# Altium project Fastino.PrjPCB (part 1 of 6)
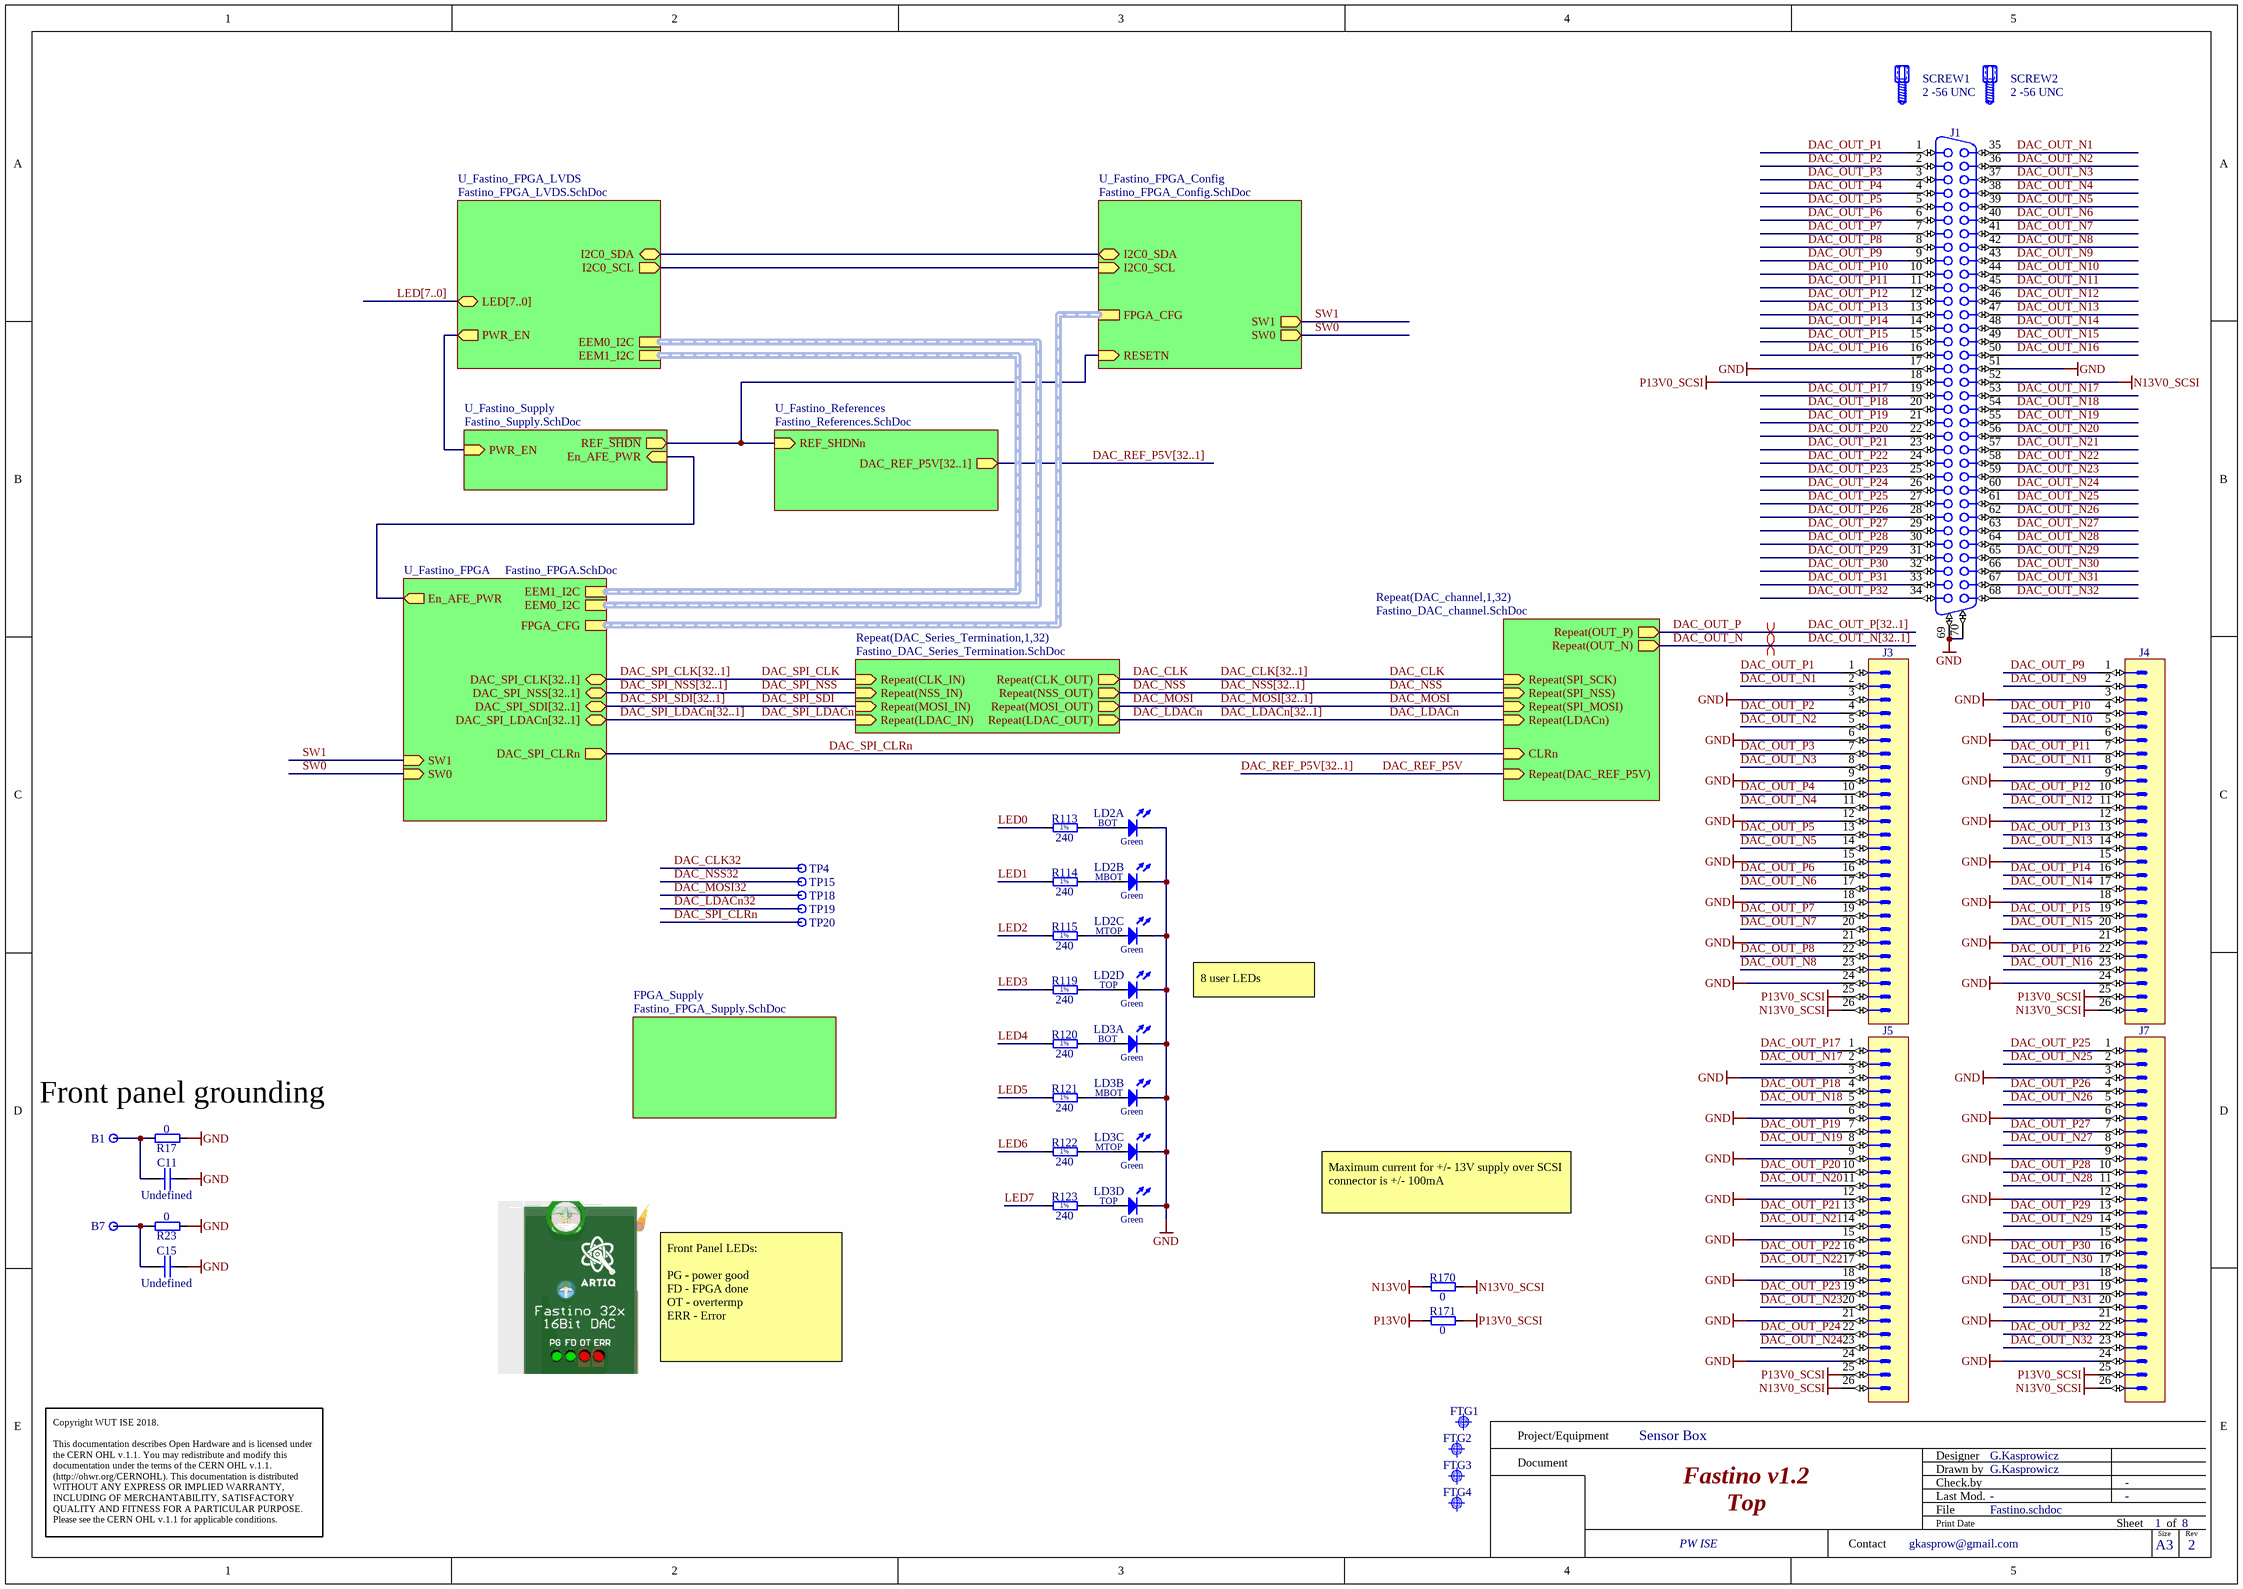
[diagram p0: Fastino.schdoc]
9 sheets, 1598 parts. Net scope: hierarchical (ports join the sheet entries above them; power ports are global).
Board files: Fastino.PCBDOC, Panel_Fastino.PcbDoc
Sheets:
  Fastino.schdoc
    DAC_channel1 = Fastino_DAC_channel.SchDoc
    DAC_channel2 = Fastino_DAC_channel.SchDoc
    DAC_channel3 = Fastino_DAC_channel.SchDoc
    DAC_channel4 = Fastino_DAC_channel.SchDoc
    DAC_channel5 = Fastino_DAC_channel.SchDoc
    DAC_channel6 = Fastino_DAC_channel.SchDoc
    DAC_channel7 = Fastino_DAC_channel.SchDoc
    DAC_channel8 = Fastino_DAC_channel.SchDoc
    DAC_channel9 = Fastino_DAC_channel.SchDoc
    DAC_channel10 = Fastino_DAC_channel.SchDoc
    DAC_channel11 = Fastino_DAC_channel.SchDoc
    DAC_channel12 = Fastino_DAC_channel.SchDoc
    DAC_channel13 = Fastino_DAC_channel.SchDoc
    DAC_channel14 = Fastino_DAC_channel.SchDoc
    DAC_channel15 = Fastino_DAC_channel.SchDoc
    DAC_channel16 = Fastino_DAC_channel.SchDoc
    DAC_channel17 = Fastino_DAC_channel.SchDoc
    DAC_channel18 = Fastino_DAC_channel.SchDoc
    DAC_channel19 = Fastino_DAC_channel.SchDoc
    DAC_channel20 = Fastino_DAC_channel.SchDoc
    DAC_channel21 = Fastino_DAC_channel.SchDoc
    DAC_channel22 = Fastino_DAC_channel.SchDoc
    DAC_channel23 = Fastino_DAC_channel.SchDoc
    DAC_channel24 = Fastino_DAC_channel.SchDoc
    DAC_channel25 = Fastino_DAC_channel.SchDoc
    DAC_channel26 = Fastino_DAC_channel.SchDoc
    DAC_channel27 = Fastino_DAC_channel.SchDoc
    DAC_channel28 = Fastino_DAC_channel.SchDoc
    DAC_channel29 = Fastino_DAC_channel.SchDoc
    DAC_channel30 = Fastino_DAC_channel.SchDoc
    DAC_channel31 = Fastino_DAC_channel.SchDoc
    DAC_channel32 = Fastino_DAC_channel.SchDoc
    U_Fastino_FPGA = Fastino_FPGA.SchDoc
    U_Fastino_FPGA_Config = Fastino_FPGA_Config.SchDoc
    U_Fastino_FPGA_LVDS = Fastino_FPGA_LVDS.SchDoc
    FPGA_Supply = Fastino_FPGA_Supply.SchDoc
    U_Fastino_References = Fastino_References.SchDoc
    U_Fastino_Supply = Fastino_Supply.SchDoc
    DAC_Series_Termination1 = Fastino_DAC_Series_Termination.SchDoc
    DAC_Series_Termination2 = Fastino_DAC_Series_Termination.SchDoc
    DAC_Series_Termination3 = Fastino_DAC_Series_Termination.SchDoc
    DAC_Series_Termination4 = Fastino_DAC_Series_Termination.SchDoc
    DAC_Series_Termination5 = Fastino_DAC_Series_Termination.SchDoc
    DAC_Series_Termination6 = Fastino_DAC_Series_Termination.SchDoc
    DAC_Series_Termination7 = Fastino_DAC_Series_Termination.SchDoc
    DAC_Series_Termination8 = Fastino_DAC_Series_Termination.SchDoc
    DAC_Series_Termination9 = Fastino_DAC_Series_Termination.SchDoc
    DAC_Series_Termination10 = Fastino_DAC_Series_Termination.SchDoc
    DAC_Series_Termination11 = Fastino_DAC_Series_Termination.SchDoc
    DAC_Series_Termination12 = Fastino_DAC_Series_Termination.SchDoc
    DAC_Series_Termination13 = Fastino_DAC_Series_Termination.SchDoc
    DAC_Series_Termination14 = Fastino_DAC_Series_Termination.SchDoc
    DAC_Series_Termination15 = Fastino_DAC_Series_Termination.SchDoc
    DAC_Series_Termination16 = Fastino_DAC_Series_Termination.SchDoc
    DAC_Series_Termination17 = Fastino_DAC_Series_Termination.SchDoc
    DAC_Series_Termination18 = Fastino_DAC_Series_Termination.SchDoc
    DAC_Series_Termination19 = Fastino_DAC_Series_Termination.SchDoc
    DAC_Series_Termination20 = Fastino_DAC_Series_Termination.SchDoc
    DAC_Series_Termination21 = Fastino_DAC_Series_Termination.SchDoc
    DAC_Series_Termination22 = Fastino_DAC_Series_Termination.SchDoc
    DAC_Series_Termination23 = Fastino_DAC_Series_Termination.SchDoc
    DAC_Series_Termination24 = Fastino_DAC_Series_Termination.SchDoc
    DAC_Series_Termination25 = Fastino_DAC_Series_Termination.SchDoc
    DAC_Series_Termination26 = Fastino_DAC_Series_Termination.SchDoc
    DAC_Series_Termination27 = Fastino_DAC_Series_Termination.SchDoc
    DAC_Series_Termination28 = Fastino_DAC_Series_Termination.SchDoc
    DAC_Series_Termination29 = Fastino_DAC_Series_Termination.SchDoc
    DAC_Series_Termination30 = Fastino_DAC_Series_Termination.SchDoc
    DAC_Series_Termination31 = Fastino_DAC_Series_Termination.SchDoc
    DAC_Series_Termination32 = Fastino_DAC_Series_Termination.SchDoc

## Sheet Fastino.schdoc: Fastino v1.2
size 420 x 297 mm; EDA_Number: ARTIQ; Projet: Fastino; Author: G.Kasprowicz; CompanyName: WUT ISE; DrawnBy: G.Kasprowicz; Organization: WUT ISE; Address1: PW ISE; Address2: Nowowiejska 15/19 00-665 Warsaw; Address3: gkasprow@gmail.com; DocumentNumber: 1; Revision: 2; SheetNumber: 1; SheetTotal: 8; ModifiedBy: -; CheckedDate: -; Title2: Top; DivGrp: WUT ISE; Designer: G.Kasprowicz; ModifiedDate: -; ProjectName: Sensor Box

### Parts
(Parts that share a designator on the sheet are numbered #1, #2 ... from top to bottom, then left to right.)
B1  Plated Hole  [MTG270_500]  (value not drawn)
B7  Plated Hole  [MTG270_500]  (value not drawn)
C11  Undefined  [CAPC2012X135N]
C15  Undefined  [CAPC2012X135N]
FTG1  Use only in PCB  [FIDUCIAL_TOP_C100-200]  (value not drawn)
FTG2  Use only in PCB  [FIDUCIAL_TOP_S100-200]  (value not drawn)
FTG3  Use only in PCB  [FIDUCIAL_TOP_S100-200]  (value not drawn)
FTG4  Use only in PCB  [FIDUCIAL_TOP_S100-200]  (value not drawn)
J1  D-SUB  [TYCO_5787082-7]  (value not drawn)
J3  Header 26  [3M_N2526-6002RB]  (value not drawn)
J4  Header 26  [3M_N2526-6002RB]  (value not drawn)
J5  Header 26  [3M_N2526-6002RB]  (value not drawn)
J7  Header 26  [3M_N2526-6002RB]  (value not drawn)
LD2  Green  [LED_BIVAR_H485CGDL]  (value not drawn)  (parts A,B,C,D of 4)
LD3  Green  [LED_BIVAR_H485CGDL]  (value not drawn)  (parts A,B,C,D of 4)
R17  0  [RESC1608X55N]
R23#1  0  [RESC1608X55N]
R113  240  [RESC1608X55N]
R114  240  [RESC1608X55N]
R115  240  [RESC1608X55N]
R119  240  [RESC1608X55N]
R120  240  [RESC1608X55N]
R121  240  [RESC1608X55N]
R122  240  [RESC1608X55N]
R123  240  [RESC1608X55N]
R170  0  [RESC3216X65N]
R171  0  [RESC3216X65N]
SCREW1  2 -56 UNC  [TYCO_786585-2]
SCREW2  2 -56 UNC  [TYCO_786585-2]
TP4  Test Point  [TPS127]  (value not drawn)
TP15  Test Point  [TPS127]  (value not drawn)
TP18  Test Point  [TPS127]  (value not drawn)
TP19  Test Point  [TPS127]  (value not drawn)
TP20  Test Point  [TPS127]  (value not drawn)

### Sub-sheets
FPGA_Supply = Fastino_FPGA_Supply.SchDoc: no entries
Repeat(DAC_channel,1,32) = Fastino_DAC_channel.SchDoc: Repeat(OUT_P) (out), Repeat(OUT_N) (out), Repeat(SPI_SCK) (in), Repeat(SPI_NSS) (in), Repeat(SPI_MOSI) (in), CLRn (in), Repeat(LDACn) (in), Repeat(DAC_REF_P5V) (in)
Repeat(DAC_Series_Termination,1,32) = Fastino_DAC_Series_Termination.SchDoc: Repeat(CLK_IN) (in), Repeat(NSS_IN) (in), Repeat(MOSI_IN) (in), Repeat(LDAC_IN) (in), Repeat(CLK_OUT) (out), Repeat(NSS_OUT) (out), Repeat(LDAC_OUT) (out), Repeat(MOSI_OUT) (out)
U_Fastino_FPGA = Fastino_FPGA.SchDoc: DAC_SPI_LDACn[32..1] (bidir), DAC_SPI_SDI[32..1] (bidir), DAC_SPI_NSS[32..1] (bidir), DAC_SPI_CLRn (out), DAC_SPI_CLK[32..1] (bidir), FPGA_CFG (harness FPGA_CFG), SW1 (in), SW0 (in), EEM1_I2C (harness I2C), EEM0_I2C (harness I2C), En_AFE_PWR (out)
U_Fastino_FPGA_Config = Fastino_FPGA_Config.SchDoc: RESETN (in), FPGA_CFG (harness FPGA_CFG), SW1 (out), SW0 (out), I2C0_SCL (in), I2C0_SDA (bidir)
U_Fastino_FPGA_LVDS = Fastino_FPGA_LVDS.SchDoc: EEM0_I2C (harness I2C), EEM1_I2C (harness I2C), PWR_EN (out), LED[7..0] (bidir), I2C0_SDA (bidir), I2C0_SCL (out)
U_Fastino_References = Fastino_References.SchDoc: REF_SHDNn (in), DAC_REF_P5V[32..1] (out)
U_Fastino_Supply = Fastino_Supply.SchDoc: REF_~{SHDN} (out), PWR_EN (in), En_AFE_PWR (in)

### Nets
GND: C11.2 C15.2 J1.17 J1.51 J1.69 J1.70 J3.3 J3.6 J3.9 J3.12 J3.15 J3.18 J3.21 J3.24 J4.3 J4.6 J4.9 J4.12 J4.15 J4.18 J4.21 J4.24 J5.3 J5.6 J5.9 J5.12 J5.15 J5.18 J5.21 J5.24 J7.3 J7.6 J7.9 J7.12 J7.15 J7.18 J7.21 J7.24 LD2.1(C) LD2.3(C) LD2.5(C) LD2.7(C) LD3.1(C) LD3.3(C) LD3.5(C) LD3.7(C) R17.1 R23#1.1
N13V0: R170.1
N13V0_SCSI: J1.52 J3.26 J4.26 J5.26 J7.26 R170.2
P13V0: R171.1
P13V0_SCSI: J1.18 J3.25 J4.25 J5.25 J7.25 R171.2
DAC_CLK: sheet Repeat(DAC_channel,1,32)/Repeat(SPI_SCK), sheet Repeat(DAC_Series_Termination,1,32)/Repeat(CLK_OUT)
DAC_CLK32: TP4.1
DAC_LDACn: sheet Repeat(DAC_channel,1,32)/Repeat(LDACn), sheet Repeat(DAC_Series_Termination,1,32)/Repeat(LDAC_OUT)
DAC_LDACn32: TP19.1
DAC_MOSI: sheet Repeat(DAC_channel,1,32)/Repeat(SPI_MOSI), sheet Repeat(DAC_Series_Termination,1,32)/Repeat(MOSI_OUT)
DAC_MOSI32: TP18.1
DAC_NSS: sheet Repeat(DAC_channel,1,32)/Repeat(SPI_NSS), sheet Repeat(DAC_Series_Termination,1,32)/Repeat(NSS_OUT)
DAC_NSS32: TP15.1
DAC_OUT_N: sheet Repeat(DAC_channel,1,32)/Repeat(OUT_N)
DAC_OUT_N1: J1.35 J3.2
DAC_OUT_N2: J1.36 J3.5
DAC_OUT_N3: J1.37 J3.8
DAC_OUT_N4: J1.38 J3.11
DAC_OUT_N5: J1.39 J3.14
DAC_OUT_N6: J1.40 J3.17
DAC_OUT_N7: J1.41 J3.20
DAC_OUT_N8: J1.42 J3.23
DAC_OUT_N9: J1.43 J4.2
DAC_OUT_N10: J1.44 J4.5
DAC_OUT_N11: J1.45 J4.8
DAC_OUT_N12: J1.46 J4.11
DAC_OUT_N13: J1.47 J4.14
DAC_OUT_N14: J1.48 J4.17
DAC_OUT_N15: J1.49 J4.20
DAC_OUT_N16: J1.50 J4.23
DAC_OUT_N17: J1.53 J5.2
DAC_OUT_N18: J1.54 J5.5
DAC_OUT_N19: J1.55 J5.8
DAC_OUT_N20: J1.56 J5.11
DAC_OUT_N21: J1.57 J5.14
DAC_OUT_N22: J1.58 J5.17
DAC_OUT_N23: J1.59 J5.20
DAC_OUT_N24: J1.60 J5.23
DAC_OUT_N25: J1.61 J7.2
DAC_OUT_N26: J1.62 J7.5
DAC_OUT_N27: J1.63 J7.8
DAC_OUT_N28: J1.64 J7.11
DAC_OUT_N29: J1.65 J7.14
DAC_OUT_N30: J1.66 J7.17
DAC_OUT_N31: J1.67 J7.20
DAC_OUT_N32: J1.68 J7.23
DAC_OUT_P: sheet Repeat(DAC_channel,1,32)/Repeat(OUT_P)
DAC_OUT_P1: J1.1 J3.1
DAC_OUT_P2: J1.2 J3.4
DAC_OUT_P3: J1.3 J3.7
DAC_OUT_P4: J1.4 J3.10
DAC_OUT_P5: J1.5 J3.13
DAC_OUT_P6: J1.6 J3.16
DAC_OUT_P7: J1.7 J3.19
DAC_OUT_P8: J1.8 J3.22
DAC_OUT_P9: J1.9 J4.1
DAC_OUT_P10: J1.10 J4.4
DAC_OUT_P11: J1.11 J4.7
DAC_OUT_P12: J1.12 J4.10
DAC_OUT_P13: J1.13 J4.13
DAC_OUT_P14: J1.14 J4.16
DAC_OUT_P15: J1.15 J4.19
DAC_OUT_P16: J1.16 J4.22
DAC_OUT_P17: J1.19 J5.1
DAC_OUT_P18: J1.20 J5.4
DAC_OUT_P19: J1.21 J5.7
DAC_OUT_P20: J1.22 J5.10
DAC_OUT_P21: J1.23 J5.13
DAC_OUT_P22: J1.24 J5.16
DAC_OUT_P23: J1.25 J5.19
DAC_OUT_P24: J1.26 J5.22
DAC_OUT_P25: J1.27 J7.1
DAC_OUT_P26: J1.28 J7.4
DAC_OUT_P27: J1.29 J7.7
DAC_OUT_P28: J1.30 J7.10
DAC_OUT_P29: J1.31 J7.13
DAC_OUT_P30: J1.32 J7.16
DAC_OUT_P31: J1.33 J7.19
DAC_OUT_P32: J1.34 J7.22
DAC_REF_P5V: sheet Repeat(DAC_channel,1,32)/Repeat(DAC_REF_P5V)
DAC_SPI_CLK: sheet Repeat(DAC_Series_Termination,1,32)/Repeat(CLK_IN)
DAC_SPI_CLRn: TP20.1 ; sheet Repeat(DAC_channel,1,32)/CLRn, sheet U_Fastino_FPGA/DAC_SPI_CLRn
DAC_SPI_LDACn: sheet Repeat(DAC_Series_Termination,1,32)/Repeat(LDAC_IN)
DAC_SPI_NSS: sheet Repeat(DAC_Series_Termination,1,32)/Repeat(NSS_IN)
DAC_SPI_SDI: sheet Repeat(DAC_Series_Termination,1,32)/Repeat(MOSI_IN)
En_AFE_PWR: sheet U_Fastino_FPGA/En_AFE_PWR, sheet U_Fastino_Supply/En_AFE_PWR
I2C0_SCL: sheet U_Fastino_FPGA_Config/I2C0_SCL, sheet U_Fastino_FPGA_LVDS/I2C0_SCL
I2C0_SDA: sheet U_Fastino_FPGA_Config/I2C0_SDA, sheet U_Fastino_FPGA_LVDS/I2C0_SDA
LED0: R113.1
LED1: R114.1
LED2: R115.1
LED3: R119.1
LED4: R120.1
LED5: R121.1
LED6: R122.1
LED7: R123.1
SW0: sheet U_Fastino_FPGA/SW0, sheet U_Fastino_FPGA_Config/SW0
SW1: sheet U_Fastino_FPGA/SW1, sheet U_Fastino_FPGA_Config/SW1
NetB1_1: B1.1 C11.1 R17.2
NetB7_1: B7.1 C15.1 R23#1.2
NetLD2_2: LD2.2(A) R113.2
NetLD2_4: LD2.4(A) R114.2
NetLD2_6: LD2.6(A) R115.2
NetLD2_8: LD2.8(A) R119.2
NetLD3_2: LD3.2(A) R120.2
NetLD3_4: LD3.4(A) R121.2
NetLD3_6: LD3.6(A) R122.2
NetLD3_8: LD3.8(A) R123.2
NetR86_2: sheet U_Fastino_FPGA_LVDS/PWR_EN, sheet U_Fastino_Supply/PWR_EN
(unnamed): sheet U_Fastino_FPGA_Config/RESETN, sheet U_Fastino_References/REF_SHDNn, sheet U_Fastino_Supply/REF_~{SHDN}

### Buses and harness runs
bus DAC_CLK[32..1]
bus DAC_LDACn[32..1]
bus DAC_MOSI[32..1]
bus DAC_NSS[32..1]
bus DAC_OUT_N[32..1]
bus DAC_OUT_P[32..1]
bus DAC_REF_P5V[32..1]
bus DAC_REF_P5V[32..1] = sheet U_Fastino_References/DAC_REF_P5V[32..1]
bus DAC_SPI_CLK[32..1] = sheet U_Fastino_FPGA/DAC_SPI_CLK[32..1]
bus DAC_SPI_LDACn[32..1] = sheet U_Fastino_FPGA/DAC_SPI_LDACn[32..1]
bus DAC_SPI_NSS[32..1] = sheet U_Fastino_FPGA/DAC_SPI_NSS[32..1]
bus DAC_SPI_SDI[32..1] = sheet U_Fastino_FPGA/DAC_SPI_SDI[32..1]
bus LED[7..0] = sheet U_Fastino_FPGA_LVDS/LED[7..0]
harness sheet U_Fastino_FPGA/EEM0_I2C = sheet U_Fastino_FPGA_LVDS/EEM0_I2C
harness sheet U_Fastino_FPGA/EEM1_I2C = sheet U_Fastino_FPGA_LVDS/EEM1_I2C
harness sheet U_Fastino_FPGA/FPGA_CFG = sheet U_Fastino_FPGA_Config/FPGA_CFG

### Layout directives
differential pair: DAC_OUT_N, DAC_OUT_P

### Notes on the sheet
- 8 user LEDs
- Front panel grounding
- Maximum current for +/- 13V supply over SCSI connector is +/- 100mA
- Front Panel LEDs:
  PG - power good
  FD - FPGA done
  OT - overtermp
  ERR - Error
- Project/Equipment
- Document
- Designer
- Drawn by
- Check.by
- Copyright WUT ISE 2018.
  This documentation describes Open Hardware and is licensed under the CERN OHL v.1.1. You may redistribute and modify this documentation under the terms of the CERN OHL v.1.1. (http://ohwr.org/CERNOHL). This documentation is distributed WITHOUT ANY EXPRESS OR IMPLIED WARRANTY, INCLUDING OF MERCHANTABILITY, SATISFACTORY QUALITY AND FITNESS FOR A PARTICULAR PURPOSE. Please see the CERN OHL v.1.1 for applicable conditions.
- Contact
- File
- Last Mod.
- Print Date
- Sheet
- Size
- A3
- of
- Rev
- (in symbol LED_BIVAR_H485CGDL, part A) BOT
- (in symbol LED_BIVAR_H485CGDL, part B) MBOT
- (in symbol LED_BIVAR_H485CGDL, part C) MTOP
- (in symbol LED_BIVAR_H485CGDL, part D) TOP
- (in symbol R0603_240R_1%_0.1W_100PPM) 1%

### Library data of the parts
B1 B7 = PLATED_HOLE2.7_PAD5.0: Single Terminal Socket; Part Description: Plated Through Hole: Hole Dia.=2.7mm Pad Dia.=5.0mm; Mounted: No; Part Number: PLATED_HOLE2.7_PAD5.0; Component Kind: Standard (No BOM); Component Type: Standard (No BOM); Pin Count: 1; Family: Plated Hole; Socket: No; SMD: No; Sense: No; Status: None; ComponentHeight: 0mm; HelpURL: Undefined; Author: CERN DEM JMW; CreateDate: 27.09.2011; LatestRevisionDate: 27.09.2011; PackageDescription: Plated Through Hole: Hole Dia.=2.7mm Pad Dia.=5.0mm
C11 C15 = CC0805_NO-VALUE: Non-polarised capacitor; Part Description: Reserved Footprint For 0805(2012) Chip Ceramic Capacitor; Mounted: No; Part Number: CC0805_NO-VALUE; Component Kind: Standard; Component Type: Standard; Pin Count: 2; Value: Undefined; Status: None; Manufacturer: Undefined; Manufacturer Part Number: CC0805_NO-VALUE; Case: 0805; Socket: No; SMD: Yes; Sense: No; Manufacturer1 ComponentHeight: 1.35mm; HelpURL: Undefined; Author: CERN DEM JLC; CreateDate: 10.12.2008; LatestRevisionDate: 11.09.2013
FTG1 = FIDUCIAL_TARGET_C100-200: Fiducial Target; Part Description: Round Fiducial Target, Top Layer, 1.0mm, Top Solder 2.0mm, Keepout =2.0mm; Mounted: No; Part Number: FIDUCIAL_TARGET_C100-200; Component Kind: Standard (No BOM); Component Type: Standard (No BOM); Pin Count: 1; Family: Fiducial; Socket: No; SMD: Yes; Sense: No; Status: None; ComponentHeight: 0mm; HelpURL: Undefined; Author: CERN DEM JLC; CreateDate: 09.02.2010; LatestRevisionDate: 04.04.2012; PackageDescription: Round Fiducial Target, Top Layer, 1.0mm, Top Solder 2.0mm, Keepout =2.0mm
FTG2-FTG4 = FIDUCIAL_TARGET_S100-200: Fiducial Target; Part Description: Square Fiducial Target, Top Layer, 1.0mm, Top Solder 2.0mm, Keepout =2.0mm; Mounted: No; Part Number: FIDUCIAL_TARGET_S100-200; Component Kind: Standard (No BOM); Component Type: Standard (No BOM); Pin Count: 1; Family: Fiducial; Socket: No; SMD: Yes; Sense: No; Status: None; ComponentHeight: 0mm; HelpURL: Undefined; Author: CERN DEM JLC; CreateDate: 09.02.2010; LatestRevisionDate: 04.04.2012; PackageDescription: Square Fiducial Target, Top Layer, 1.0mm, Top Solder 2.0mm, Keepout =2.0mm
J1 = TYCO_5787082-7: 68 contacts, AMPLIMITE .050", Right Angled Receptacle Series III; Manufacturer: TYCO ELECTRONICS; PressFit: No; Part Number: TYCO_5787082-7; Component Kind: Standard; Component Type: Standard; Pin Count: 70; Family: D-SUB; Mounted: Yes; Socket: No; SMD: No; Sense: No; Status: None; Part Description: 68 contacts, AMPLIMITE .050", Right Angled Receptacle Series III; Manufacturer Part Number: 5787082-7; ComponentHeight: 9.5mm; HelpURL: \\cern.ch\dfs\Applications\Altium\Datasheets\TYCO_5787082-7.pdf; Author: CERN DEM JLC; CreateDate: 13.03.2017; LatestRevisionDate: 13.03.2017
J3-J5 J7 = 3M_N2526-6002RB: Connector 26 Male; Part Description: 26 Contacts - Straight .100'' x .100'' Low Profile Four-Wall Header, 2500 Series; Manufacturer: 3M; PressFit: No; Part Number: 3M_N2526-6002RB; Component Kind: Standard; Component Type: Standard; Pin Count: 26; Family: Header 26; Mounted: Yes; Socket: No; SMD: No; Sense: No; Status: None; Manufacturer Part Number: N2526-6002RB; ComponentHeight: 10.03mm; HelpURL: \\cern.ch\dfs\Applications\Altium\Datasheets\3M_N2526-6002RB.pdf; Author: CERN DEM JLC; CreateDate: 11.02.2009; LatestRevisionDate: 11.08.2009
LD2 LD3 = LED_BIVAR_H485CGDL: LED x4 Green 1C2A-BOT_3C4A_5C6A_7C8A-TOP; Part Description: Quad-Level 2mm Green LED, PCB Edge Mounting; Manufacturer: BIVAR; PressFit: No; Bonding: No; Part Number: LED_BIVAR_H485CGDL; Component Kind: Standard; Component Type: Standard; Color: Green; PackageDescription: Quad-Level 2mm Green, PCB Edge Mounting  BIVAR H485CHDL; Manufacturer Part Number: H485CGDL; Pin Count: 8; Mounted: Yes; Socket: No; SMD: No; Sense: No; ComponentHeight: 11.3mm; HelpURL: \\cern.ch\dfs\Applications\Altium\Datasheets\LED_BIVAR_H485CGDL.pdf; Author: CERN DEM JLC; CreateDate: 04.06.2012; LatestRevisionDate: 04.06.2012
R17 R23#1 = R0603_0R_JUMPER: Resistor; Part Description: 1A (0.05R Max DC Resistance) Zero Ohm Jumper; Manufacturer: GENERIC; Manufacturer1 Part Number: NRC06Z0; PressFit: No; Part Number: R0603_0R_JUMPER; Component Kind: Standard; Component Type: Standard; Pin Count: 2; Value: 0; Status: Preferred; Manufacturer Part Number: R0603_0R_JUMPER; Case: 0603; Mounted: Yes; Sense: No; Socket: No; SMD: Yes; Manufacturer1 Example: NIC COMPONENT; Manufacturer1 ComponentHeight: 0.55mm; HelpURL: \\cern.ch\dfs\Applications\Altium\Datasheets\R0603_NIC_NRC.pdf; Author: CERN DEM JLC; CreateDate: 03.12.2007; LatestRevisionDate: 13.03.2008
R113-R115 R119-R123 = R0603_240R_1%_0.1W_100PPM: Resistor - 1%; Part Description: General Purpose Thick Film Chip Resistor; Manufacturer: GENERIC; Manufacturer1 Part Number: NRC06F2400TRF; Power: 0.1W; TC: ±100ppm/°C; PressFit: No; Part Number: R0603_240R_1%_0.1W_100PPM; Component Kind: Standard; Component Type: Standard; Pin Count: 2; Value: 240; Status: Preferred; Tolerance: ±1%; Manufacturer Part Number: R0603_240R_1%_0.1W_100PPM; Case: 0603; Mounted: Yes; Sense: No; Socket: No; SMD: Yes; Manufacturer1 Example: NIC COMPONENT; Manufacturer1 ComponentHeight: 0.55mm; HelpURL: \\cern.ch\dfs\Applications\Altium\Datasheets\R0603_NIC_NRC.pdf; Author: CERN DEM JLC; CreateDate: 03.12.2007; LatestRevisionDate: 13.03.2008
R170 R171 = R1206_0R_Jumper: Resistor; Part Description: 2A (0.05R Max DC Resistance) Zero Ohm Jumper; Manufacturer: GENERIC; Manufacturer1 Part Number: NRC12Z0; PressFit: No; Part Number: R1206_0R_JUMPER; Component Kind: Standard; Component Type: Standard; Pin Count: 2; Value: 0; Status: Preferred; Manufacturer Part Number: R1206_0R_JUMPER; Case: 1206; Mounted: Yes; Sense: No; Socket: No; SMD: Yes; Manufacturer1 Example: NIC COMPONENT; Manufacturer1 ComponentHeight: 0.65mm; HelpURL: \\cern.ch\dfs\Applications\Altium\Datasheets\R1206_NIC_NRC.pdf; Author: CERN DEM JLC; CreateDate: 03.12.2007; LatestRevisionDate: 13.03.2008
SCREW1 SCREW2 = MECH_Tyco_SCSI_Screwlock: SCSI Screw Lock; Part Description: 50SR SCREWLOCK KIT, FEMALE; Manufacturer: TYCO ELECTRONICS; Manufacturer Part Number: 786585-2; PressFit: No; Part Number: TYCO_786585-2; Component Kind: Standard; Component Type: Mechanical; Pin Count: 0; PackageDescription: 50SR SCREWLOCK KIT, FEMALE; Mounted: Yes; Socket: No; SMD: No; Sense: No; Status: None; Value: 2 -56 UNC; ComponentHeight: 9.02mm; Author: GK; CreateDate: 10.09.2013; LatestRevisionDate: 10.09.2013
TP4 TP15 TP18-TP20 = SMD_PAD_1.27X1.27MM: Part Description: 1.27mm x 1.27mm PCB Copper Area (SMD Test Point); Mounted: No; Part Number: SMD_PAD_1.27X1.27MM; Component Kind: Standard (No BOM); Component Type: Standard (No BOM); Pin Count: 1; Family: Test Point; Socket: No; SMD: No; Sense: No; Status: None; ComponentHeight: 0mm; HelpURL: Undefined; Author: CERN DEM JLC; CreateDate: 12.01.2008; LatestRevisionDate: 12.01.2008; PackageDescription: 1.27mm x 1.27mm PCB Copper Area (SMD Test Point)

## Sheet Fastino_DAC_channel.SchDoc: Fastino
size 420 x 297 mm; EDA_Number: ARTIQ; Projet: Fastino; Author: G.Kasprowicz; CompanyName: WUT ISE; DrawnBy: G.Kasprowicz; Organization: WUT ISE; Address1: PW ISE; Address2: Nowowiejska 15/19 00-665 Warsaw; Address3: gkasprow@gmail.com; DocumentNumber: 2; Revision: 2; SheetNumber: 2; SheetTotal: 11; ModifiedBy: -; CheckedDate: -; Title2: DAC channel; DivGrp: WUT ISE; Designer: G.Kasprowicz; ModifiedDate: -; ProjectName: Sensor Box
Used 32 times, as channels DAC_channel1, DAC_channel2, DAC_channel3, DAC_channel4, DAC_channel5, DAC_channel6, DAC_channel7, DAC_channel8, DAC_channel9, DAC_channel10, DAC_channel11, DAC_channel12, DAC_channel13, DAC_channel14, DAC_channel15, DAC_channel16, DAC_channel17, DAC_channel18, DAC_channel19, DAC_channel20, DAC_channel21, DAC_channel22, DAC_channel23, DAC_channel24, DAC_channel25, DAC_channel26, DAC_channel27, DAC_channel28, DAC_channel29, DAC_channel30, DAC_channel31, DAC_channel32. Parts and nets are listed once, with the designators drawn on the sheet.
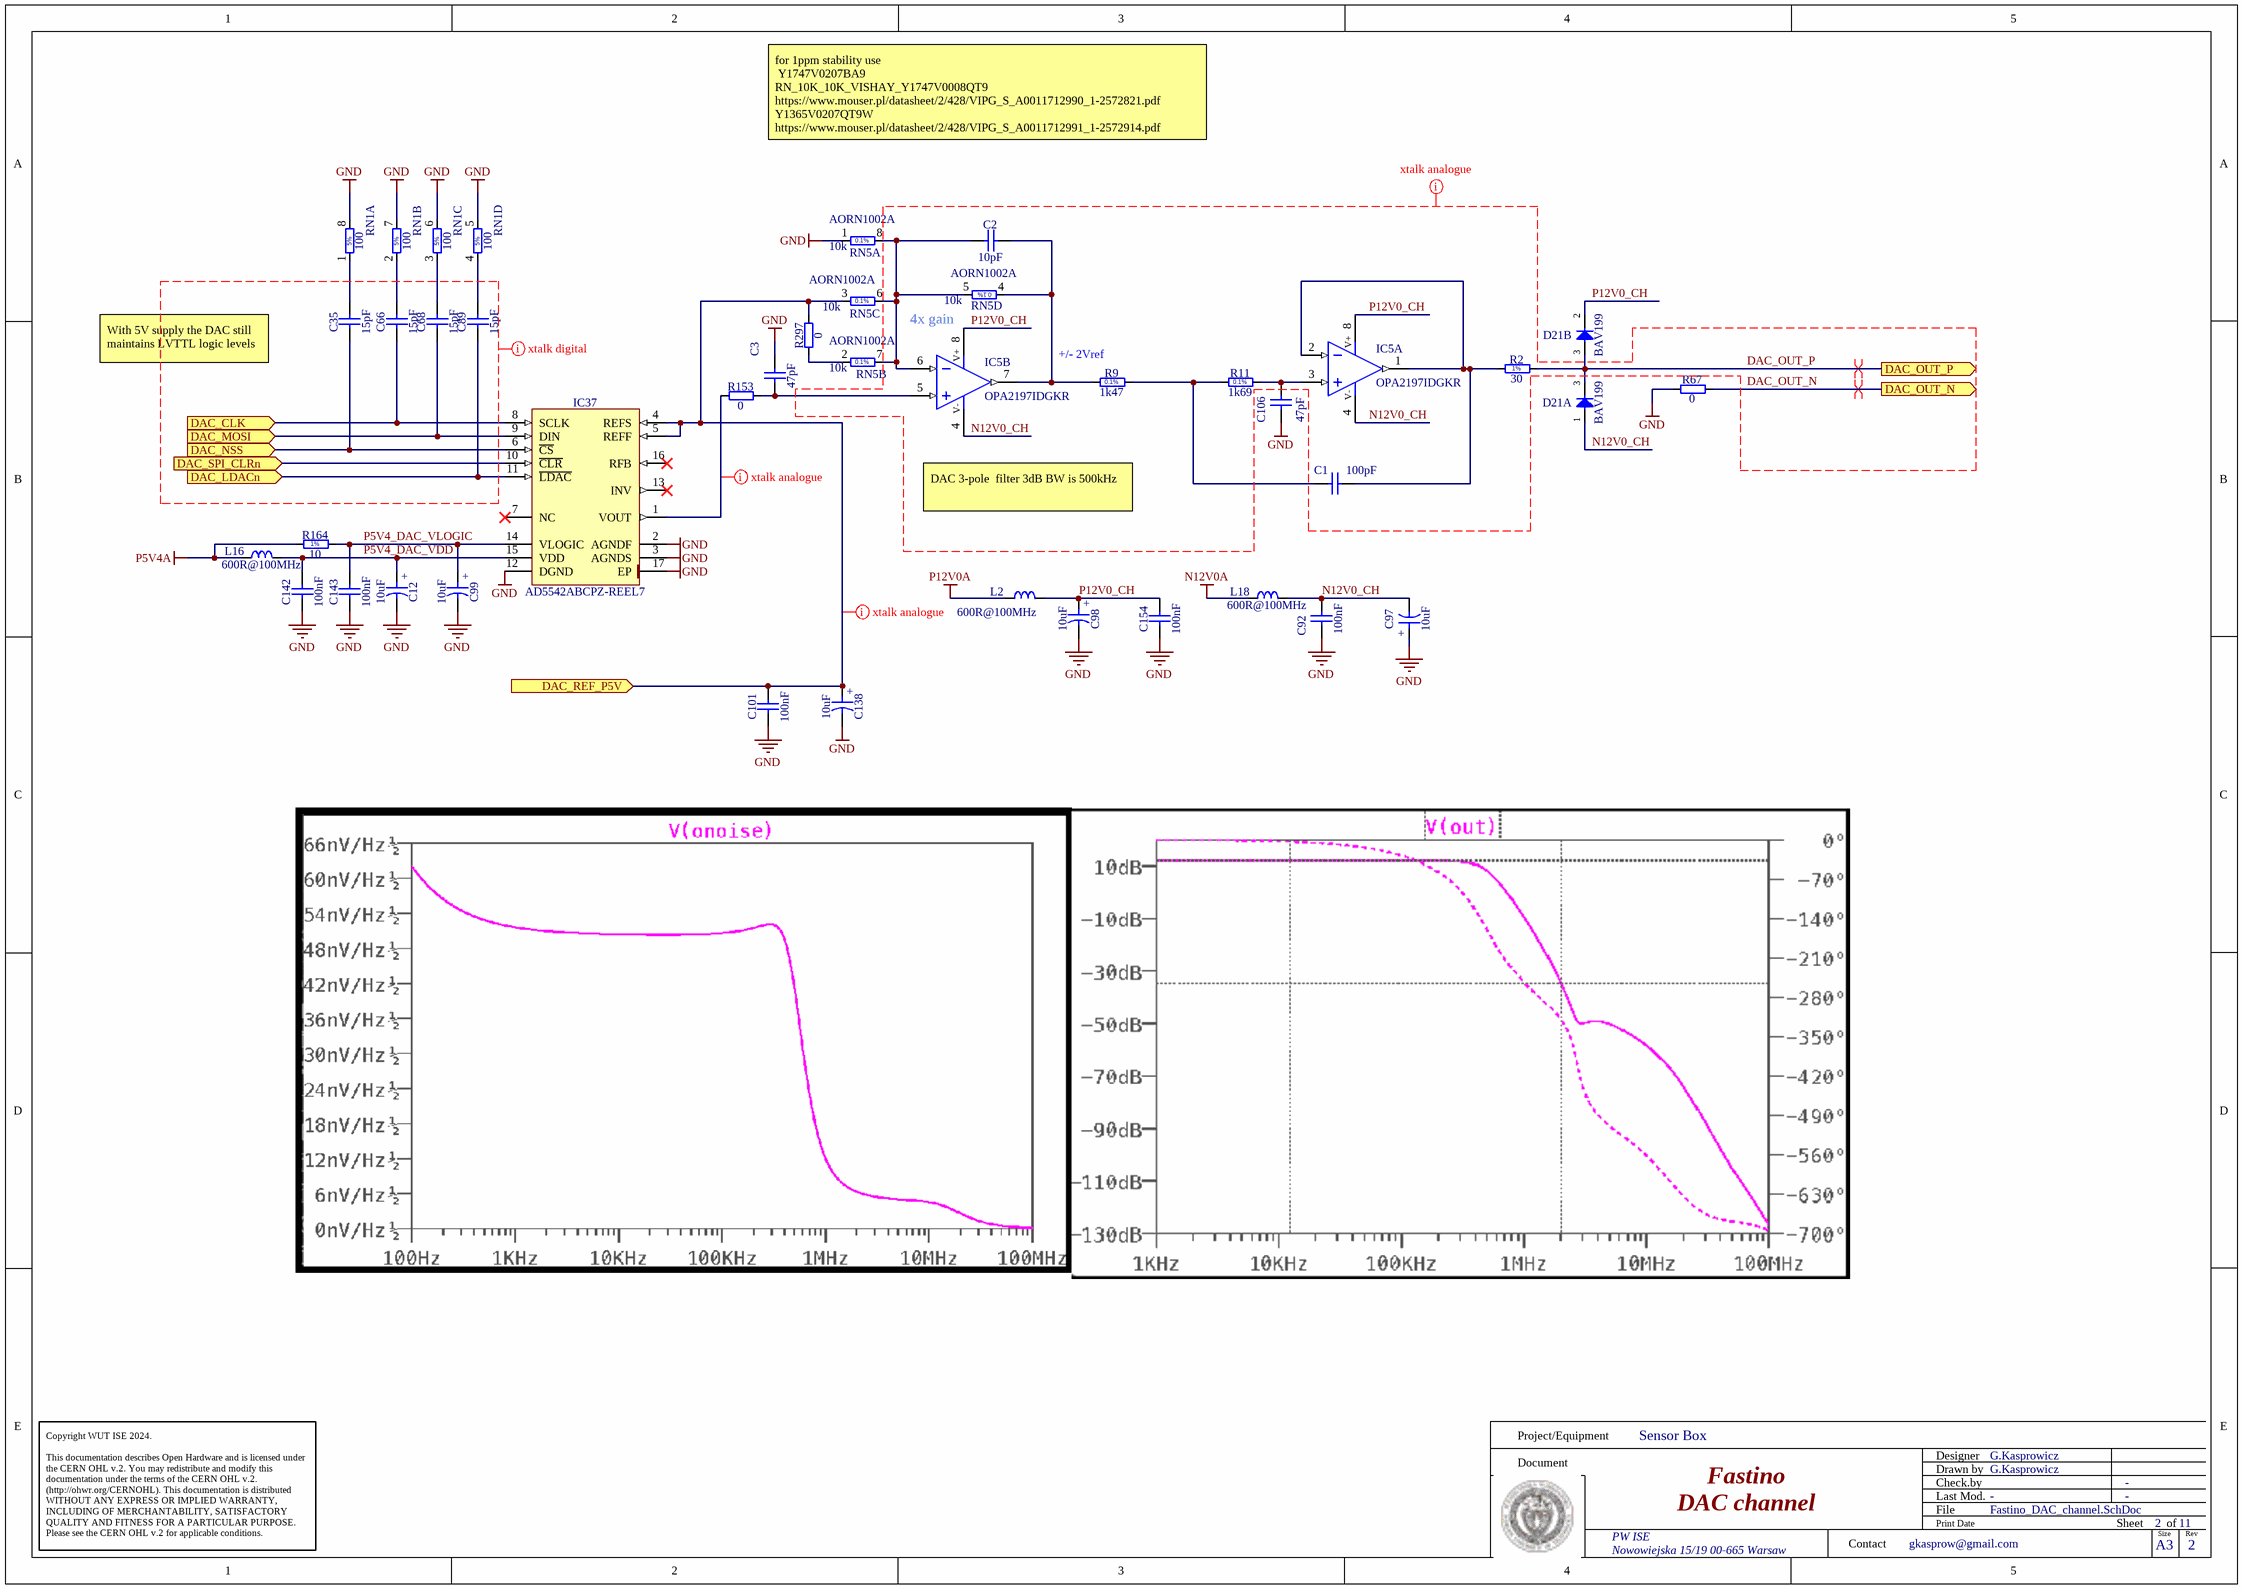
[diagram p1: Fastino_DAC_channel.SchDoc]

### Parts
C1  100pF  [CAPC1608X90N]
C2  10pF  [CAPC1005X55N]
C3  47pF  [CAPC1005X55N]
C12  10uF  [CAPMP3216X180N]
C35  15pF  [CAPC1608X87N]
C66  15pF  [CAPC1608X87N]
C68  15pF  [CAPC1608X87N]
C89  15pF  [CAPC1608X87N]
C92  100nF  [CAPC1005X55N]
C97  10uF  [CAPMP3216X180N]
C98  10uF  [CAPMP3216X180N]
C99  10uF  [CAPMP3216X180N]
C101  100nF  [CAPC1005X55N]
C106  value 47pF  [CAPC1005X55N]
C138  10uF  [CAPMP3216X180N]
C142  100nF  [CAPC1005X55N]
C143  100nF  [CAPC1005X55N]
C154  100nF  [CAPC1005X55N]
D21  BAV199  [SOT95P240X110-3N]  (parts A,B of 2)
IC5  OPA2197IDGKR  [SOP65P490X110-8N]  (parts A,B of 2)
IC37  AD5542ABCPZ-REEL7  [QFN50P300X300X80-17N-S175]
L2  600R@100MHz  [INDC1005X55N]
L16  600R@100MHz  [INDC1005X55N]
L18  600R@100MHz  [INDC1005X55N]
R2  30  [RESC1608X55N]
R9  1k47  [RESC1608X55N]
R11  1k69  [RESC1608X55N]
R67  0  [RESC1608X55N]
R153  0  [RESC1005X40N]
R164  10  [RESC1005X40N]
R297  0  [RESC0603X28N]
RN1  100  [RN_YAGEO_TC124]  (parts A,B,C,D of 4)
RN5  Manufacturer Part Number: AORN1002A  [SOIC127P600X175-8N]  (hidden comment: 10k)  (parts A,B,C,D of 4)

### Ports
DAC_CLK (in), DAC_LDACn (in), DAC_MOSI (in), DAC_NSS (in), DAC_OUT_N (out), DAC_OUT_P (out), DAC_REF_P5V (in), DAC_SPI_CLRn (in)

### Nets
GND: C3.2 C12.2 C92.1 C97.1 C98.2 C99.2 C101.1 C106.1 C138.2 C142.1 C143.1 C154.1 IC37.2(AGNDF) IC37.3(AGNDS) IC37.12(DGND) IC37.17(EP) R67.1 RN1.5 RN1.6 RN1.7 RN1.8 RN5.1
N12V0A: L18.1
P5V4A: L16.1 R164.1
P12V0A: L2.1
DAC_CLK: C66.1 IC37.8(SCLK) ; port DAC_CLK
DAC_LDACn: C89.1 IC37.11(~{LDAC}) ; port DAC_LDACn
DAC_MOSI: C68.1 IC37.9(DIN) ; port DAC_MOSI
DAC_NSS: C35.1 IC37.6(~{CS}) ; port DAC_NSS
DAC_OUT_N: R67.2 ; port DAC_OUT_N
DAC_OUT_P: D21.3(COMAC) R2.2 ; port DAC_OUT_P
DAC_REF_P5V: C101.2 C138.1 IC37.4(REFS) IC37.5(REFF) R297.2 RN5.3 ; port DAC_REF_P5V
DAC_SPI_CLRn: IC37.10(~{CLR}) ; port DAC_SPI_CLRn
N12V0_CH: C92.2 C97.2 D21.1(A) IC5.4(V-) L18.2
P5V4_DAC_VDD: C12.1 C142.2 IC37.15(VDD) L16.2
P5V4_DAC_VLOGIC: C99.1 C143.2 IC37.14(VLOGIC) R164.2
P12V0_CH: C98.1 C154.2 D21.2(C) IC5.8(V+) L2.2
NetC1_1: C1.1 IC5.1(OUT) IC5.2(IN-) R2.1
NetC1_2: C1.2 R9.2 R11.1
NetC2_1: C2.1 IC5.6(IN-) RN5.5 RN5.6 RN5.7 RN5.8
NetC2_2: C2.2 IC5.7(OUT) R9.1 RN5.4
NetC3_1: C3.1 IC5.5(IN+) R153.2
NetC35_2: C35.2 RN1.1
NetC66_2: C66.2 RN1.2
NetC68_2: C68.2 RN1.3
NetC89_2: C89.2 RN1.4
NetC106_2: C106.2 IC5.3(IN+) R11.2
NetIC37_1: IC37.1(VOUT) R153.1
NetR297_1: R297.1 RN5.2

Not connected (* = marked no-connect by the designer): IC37 7(NC)* 13(INV)* 16(RFB)*

### Channels
DAC_channel1: designators end in _1; ports DAC_CLK=NetC66_1_1 DAC_LDACn=NetC89_1_1 DAC_MOSI=NetC68_1_1 DAC_NSS=NetC35_1_1 DAC_OUT_N=DAC_OUT_N_DAC_channel1 DAC_OUT_P=DAC_OUT_P_DAC_channel1 DAC_REF_P5V=DAC_REF_P5V1 DAC_SPI_CLRn=NetIC37_1_10
DAC_channel2: designators end in _2; ports DAC_CLK=NetC66_2_1 DAC_LDACn=NetC89_2_1 DAC_MOSI=NetC68_2_1 DAC_NSS=NetC35_2_1 DAC_OUT_N=DAC_OUT_N_DAC_channel2 DAC_OUT_P=DAC_OUT_P_DAC_channel2 DAC_REF_P5V=DAC_REF_P5V2 DAC_SPI_CLRn=NetIC37_2_10
DAC_channel3: designators end in _3; ports DAC_CLK=NetC66_3_1 DAC_LDACn=NetC89_3_1 DAC_MOSI=NetC68_3_1 DAC_NSS=NetC35_3_1 DAC_OUT_N=DAC_OUT_N_DAC_channel3 DAC_OUT_P=DAC_OUT_P_DAC_channel3 DAC_REF_P5V=DAC_REF_P5V3 DAC_SPI_CLRn=NetIC37_3_10
DAC_channel4: designators end in _4; ports DAC_CLK=NetC66_4_1 DAC_LDACn=NetC89_4_1 DAC_MOSI=NetC68_4_1 DAC_NSS=NetC35_4_1 DAC_OUT_N=DAC_OUT_N_DAC_channel4 DAC_OUT_P=DAC_OUT_P_DAC_channel4 DAC_REF_P5V=DAC_REF_P5V4 DAC_SPI_CLRn=NetIC37_4_10
DAC_channel5: designators end in _5; ports DAC_CLK=NetC66_5_1 DAC_LDACn=NetC89_5_1 DAC_MOSI=NetC68_5_1 DAC_NSS=NetC35_5_1 DAC_OUT_N=DAC_OUT_N_DAC_channel5 DAC_OUT_P=DAC_OUT_P_DAC_channel5 DAC_REF_P5V=DAC_REF_P5V5 DAC_SPI_CLRn=NetIC37_5_10
DAC_channel6: designators end in _6; ports DAC_CLK=NetC66_6_1 DAC_LDACn=NetC89_6_1 DAC_MOSI=NetC68_6_1 DAC_NSS=NetC35_6_1 DAC_OUT_N=DAC_OUT_N_DAC_channel6 DAC_OUT_P=DAC_OUT_P_DAC_channel6 DAC_REF_P5V=DAC_REF_P5V6 DAC_SPI_CLRn=NetIC37_6_10
DAC_channel7: designators end in _7; ports DAC_CLK=NetC66_7_1 DAC_LDACn=NetC89_7_1 DAC_MOSI=NetC68_7_1 DAC_NSS=NetC35_7_1 DAC_OUT_N=DAC_OUT_N_DAC_channel7 DAC_OUT_P=DAC_OUT_P_DAC_channel7 DAC_REF_P5V=DAC_REF_P5V7 DAC_SPI_CLRn=NetIC37_7_10
DAC_channel8: designators end in _8; ports DAC_CLK=NetC66_8_1 DAC_LDACn=NetC89_8_1 DAC_MOSI=NetC68_8_1 DAC_NSS=NetC35_8_1 DAC_OUT_N=DAC_OUT_N_DAC_channel8 DAC_OUT_P=DAC_OUT_P_DAC_channel8 DAC_REF_P5V=DAC_REF_P5V8 DAC_SPI_CLRn=NetIC37_8_10
DAC_channel9: designators end in _9; ports DAC_CLK=NetC66_9_1 DAC_LDACn=NetC89_9_1 DAC_MOSI=NetC68_9_1 DAC_NSS=NetC35_9_1 DAC_OUT_N=DAC_OUT_N_DAC_channel9 DAC_OUT_P=DAC_OUT_P_DAC_channel9 DAC_REF_P5V=DAC_REF_P5V9 DAC_SPI_CLRn=NetIC37_9_10
DAC_channel10: designators end in _10; ports DAC_CLK=NetC66_10_1 DAC_LDACn=NetC89_10_1 DAC_MOSI=NetC68_10_1 DAC_NSS=NetC35_10_1 DAC_OUT_N=DAC_OUT_N_DAC_channel10 DAC_OUT_P=DAC_OUT_P_DAC_channel10 DAC_REF_P5V=DAC_REF_P5V10 DAC_SPI_CLRn=NetIC37_10_10
DAC_channel11: designators end in _11; ports DAC_CLK=NetC66_11_1 DAC_LDACn=NetC89_11_1 DAC_MOSI=NetC68_11_1 DAC_NSS=NetC35_11_1 DAC_OUT_N=DAC_OUT_N_DAC_channel11 DAC_OUT_P=DAC_OUT_P_DAC_channel11 DAC_REF_P5V=DAC_REF_P5V11 DAC_SPI_CLRn=NetIC37_11_10
DAC_channel12: designators end in _12; ports DAC_CLK=NetC66_12_1 DAC_LDACn=NetC89_12_1 DAC_MOSI=NetC68_12_1 DAC_NSS=NetC35_12_1 DAC_OUT_N=DAC_OUT_N_DAC_channel12 DAC_OUT_P=DAC_OUT_P_DAC_channel12 DAC_REF_P5V=DAC_REF_P5V12 DAC_SPI_CLRn=NetIC37_12_10
DAC_channel13: designators end in _13; ports DAC_CLK=NetC66_13_1 DAC_LDACn=NetC89_13_1 DAC_MOSI=NetC68_13_1 DAC_NSS=NetC35_13_1 DAC_OUT_N=DAC_OUT_N_DAC_channel13 DAC_OUT_P=DAC_OUT_P_DAC_channel13 DAC_REF_P5V=DAC_REF_P5V13 DAC_SPI_CLRn=NetIC37_13_10
DAC_channel14: designators end in _14; ports DAC_CLK=NetC66_14_1 DAC_LDACn=NetC89_14_1 DAC_MOSI=NetC68_14_1 DAC_NSS=NetC35_14_1 DAC_OUT_N=DAC_OUT_N_DAC_channel14 DAC_OUT_P=DAC_OUT_P_DAC_channel14 DAC_REF_P5V=DAC_REF_P5V14 DAC_SPI_CLRn=NetIC37_14_10
DAC_channel15: designators end in _15; ports DAC_CLK=NetC66_15_1 DAC_LDACn=NetC89_15_1 DAC_MOSI=NetC68_15_1 DAC_NSS=NetC35_15_1 DAC_OUT_N=DAC_OUT_N_DAC_channel15 DAC_OUT_P=DAC_OUT_P_DAC_channel15 DAC_REF_P5V=DAC_REF_P5V15 DAC_SPI_CLRn=NetIC37_15_10
DAC_channel16: designators end in _16; ports DAC_CLK=NetC66_16_1 DAC_LDACn=NetC89_16_1 DAC_MOSI=NetC68_16_1 DAC_NSS=NetC35_16_1 DAC_OUT_N=DAC_OUT_N_DAC_channel16 DAC_OUT_P=DAC_OUT_P_DAC_channel16 DAC_REF_P5V=DAC_REF_P5V16 DAC_SPI_CLRn=NetIC37_16_10
DAC_channel17: designators end in _17; ports DAC_CLK=NetC66_17_1 DAC_LDACn=NetC89_17_1 DAC_MOSI=NetC68_17_1 DAC_NSS=NetC35_17_1 DAC_OUT_N=DAC_OUT_N_DAC_channel17 DAC_OUT_P=DAC_OUT_P_DAC_channel17 DAC_REF_P5V=DAC_REF_P5V17 DAC_SPI_CLRn=NetIC37_17_10
DAC_channel18: designators end in _18; ports DAC_CLK=NetC66_18_1 DAC_LDACn=NetC89_18_1 DAC_MOSI=NetC68_18_1 DAC_NSS=NetC35_18_1 DAC_OUT_N=DAC_OUT_N_DAC_channel18 DAC_OUT_P=DAC_OUT_P_DAC_channel18 DAC_REF_P5V=DAC_REF_P5V18 DAC_SPI_CLRn=NetIC37_18_10
DAC_channel19: designators end in _19; ports DAC_CLK=NetC66_19_1 DAC_LDACn=NetC89_19_1 DAC_MOSI=NetC68_19_1 DAC_NSS=NetC35_19_1 DAC_OUT_N=DAC_OUT_N_DAC_channel19 DAC_OUT_P=DAC_OUT_P_DAC_channel19 DAC_REF_P5V=DAC_REF_P5V19 DAC_SPI_CLRn=NetIC37_19_10
DAC_channel20: designators end in _20; ports DAC_CLK=NetC66_20_1 DAC_LDACn=NetC89_20_1 DAC_MOSI=NetC68_20_1 DAC_NSS=NetC35_20_1 DAC_OUT_N=DAC_OUT_N_DAC_channel20 DAC_OUT_P=DAC_OUT_P_DAC_channel20 DAC_REF_P5V=DAC_REF_P5V20 DAC_SPI_CLRn=NetIC37_20_10
DAC_channel21: designators end in _21; ports DAC_CLK=NetC66_21_1 DAC_LDACn=NetC89_21_1 DAC_MOSI=NetC68_21_1 DAC_NSS=NetC35_21_1 DAC_OUT_N=DAC_OUT_N_DAC_channel21 DAC_OUT_P=DAC_OUT_P_DAC_channel21 DAC_REF_P5V=DAC_REF_P5V21 DAC_SPI_CLRn=NetIC37_21_10
DAC_channel22: designators end in _22; ports DAC_CLK=NetC66_22_1 DAC_LDACn=NetC89_22_1 DAC_MOSI=NetC68_22_1 DAC_NSS=NetC35_22_1 DAC_OUT_N=DAC_OUT_N_DAC_channel22 DAC_OUT_P=DAC_OUT_P_DAC_channel22 DAC_REF_P5V=DAC_REF_P5V22 DAC_SPI_CLRn=NetIC37_22_10
DAC_channel23: designators end in _23; ports DAC_CLK=NetC66_23_1 DAC_LDACn=NetC89_23_1 DAC_MOSI=NetC68_23_1 DAC_NSS=NetC35_23_1 DAC_OUT_N=DAC_OUT_N_DAC_channel23 DAC_OUT_P=DAC_OUT_P_DAC_channel23 DAC_REF_P5V=DAC_REF_P5V23 DAC_SPI_CLRn=NetIC37_23_10
DAC_channel24: designators end in _24; ports DAC_CLK=NetC66_24_1 DAC_LDACn=NetC89_24_1 DAC_MOSI=NetC68_24_1 DAC_NSS=NetC35_24_1 DAC_OUT_N=DAC_OUT_N_DAC_channel24 DAC_OUT_P=DAC_OUT_P_DAC_channel24 DAC_REF_P5V=DAC_REF_P5V24 DAC_SPI_CLRn=NetIC37_24_10
DAC_channel25: designators end in _25; ports DAC_CLK=NetC66_25_1 DAC_LDACn=NetC89_25_1 DAC_MOSI=NetC68_25_1 DAC_NSS=NetC35_25_1 DAC_OUT_N=DAC_OUT_N_DAC_channel25 DAC_OUT_P=DAC_OUT_P_DAC_channel25 DAC_REF_P5V=DAC_REF_P5V25 DAC_SPI_CLRn=NetIC37_25_10
DAC_channel26: designators end in _26; ports DAC_CLK=NetC66_26_1 DAC_LDACn=NetC89_26_1 DAC_MOSI=NetC68_26_1 DAC_NSS=NetC35_26_1 DAC_OUT_N=DAC_OUT_N_DAC_channel26 DAC_OUT_P=DAC_OUT_P_DAC_channel26 DAC_REF_P5V=DAC_REF_P5V26 DAC_SPI_CLRn=NetIC37_26_10
DAC_channel27: designators end in _27; ports DAC_CLK=NetC66_27_1 DAC_LDACn=NetC89_27_1 DAC_MOSI=NetC68_27_1 DAC_NSS=NetC35_27_1 DAC_OUT_N=DAC_OUT_N_DAC_channel27 DAC_OUT_P=DAC_OUT_P_DAC_channel27 DAC_REF_P5V=DAC_REF_P5V27 DAC_SPI_CLRn=NetIC37_27_10
DAC_channel28: designators end in _28; ports DAC_CLK=NetC66_28_1 DAC_LDACn=NetC89_28_1 DAC_MOSI=NetC68_28_1 DAC_NSS=NetC35_28_1 DAC_OUT_N=DAC_OUT_N_DAC_channel28 DAC_OUT_P=DAC_OUT_P_DAC_channel28 DAC_REF_P5V=DAC_REF_P5V28 DAC_SPI_CLRn=NetIC37_28_10
DAC_channel29: designators end in _29; ports DAC_CLK=NetC66_29_1 DAC_LDACn=NetC89_29_1 DAC_MOSI=NetC68_29_1 DAC_NSS=NetC35_29_1 DAC_OUT_N=DAC_OUT_N_DAC_channel29 DAC_OUT_P=DAC_OUT_P_DAC_channel29 DAC_REF_P5V=DAC_REF_P5V29 DAC_SPI_CLRn=NetIC37_29_10
DAC_channel30: designators end in _30; ports DAC_CLK=NetC66_30_1 DAC_LDACn=NetC89_30_1 DAC_MOSI=NetC68_30_1 DAC_NSS=NetC35_30_1 DAC_OUT_N=DAC_OUT_N_DAC_channel30 DAC_OUT_P=DAC_OUT_P_DAC_channel30 DAC_REF_P5V=DAC_REF_P5V30 DAC_SPI_CLRn=NetIC37_30_10
DAC_channel31: designators end in _31; ports DAC_CLK=NetC66_31_1 DAC_LDACn=NetC89_31_1 DAC_MOSI=NetC68_31_1 DAC_NSS=NetC35_31_1 DAC_OUT_N=DAC_OUT_N_DAC_channel31 DAC_OUT_P=DAC_OUT_P_DAC_channel31 DAC_REF_P5V=DAC_REF_P5V31 DAC_SPI_CLRn=NetIC37_31_10
DAC_channel32: designators end in _32; ports DAC_CLK=NetC66_32_1 DAC_LDACn=NetC89_32_1 DAC_MOSI=NetC68_32_1 DAC_NSS=NetC35_32_1 DAC_OUT_N=DAC_OUT_N_DAC_channel32 DAC_OUT_P=DAC_OUT_P_DAC_channel32 DAC_REF_P5V=DAC_REF_P5V32 DAC_SPI_CLRn=NetIC37_32_10

### Layout directives
differential pair: DAC_OUT_N_DAC_channel1, DAC_OUT_P_DAC_channel1
net class xtalk analogue: DAC_OUT_N, DAC_OUT_P, DAC_REF_P5V1, N12V0_CH, NetIC37_1_1, P12V0_CH
net class xtalk digital: (no net found under the mark)

### Notes on the sheet
- for 1ppm stability use
  Y1747V0207BA9
  RN_10K_10K_VISHAY_Y1747V0008QT9
  https://www.mouser.pl/datasheet/2/428/VIPG_S_A0011712990_1-2572821.pdf
  Y1365V0207QT9W
  https://www.mouser.pl/datasheet/2/428/VIPG_S_A0011712991_1-2572914.pdf
- 4x gain
- With 5V supply the DAC still maintains LVTTL logic levels
- (near R9) +/- 2Vref
- DAC 3-pole  filter 3dB BW is 500kHz
- Project/Equipment
- Document
- Designer
- Drawn by
- Check.by
- Copyright WUT ISE 2024.
  This documentation describes Open Hardware and is licensed under the CERN OHL v.2. You may redistribute and modify this documentation under the terms of the CERN OHL v.2. (http://ohwr.org/CERNOHL). This documentation is distributed WITHOUT ANY EXPRESS OR IMPLIED WARRANTY, INCLUDING OF MERCHANTABILITY, SATISFACTORY QUALITY AND FITNESS FOR A PARTICULAR PURPOSE. Please see the CERN OHL v.2 for applicable conditions.
- Contact
- File
- Last Mod.
- Print Date
- Sheet
- Size
- A3
- of
- Rev
- (in symbol CTE3216-18_10UF_16V_20%_AVX_TCJ) +
- (in symbol R0402_10R_1%_0.0625W_200PPM) 1%
- (in symbol R0603_1K47_0.1%_0.063W_10PPM) 0.1%
- (in symbol R0603_1K69_0.1%_0.063W_10PPM) 0.1%
- (in symbol R0603_30R_1%_0.1W_100PPM) 1%
- (in symbol RES_RN_100R_YAGEO_TC124-JR-07100RL, part A) 5%
- (in symbol RES_RN_100R_YAGEO_TC124-JR-07100RL, part B) 5%
- (in symbol RES_RN_100R_YAGEO_TC124-JR-07100RL, part C) 5%
- (in symbol RES_RN_100R_YAGEO_TC124-JR-07100RL, part D) 5%
- (in symbol RN_10K_VISHAY_AORN1002A, part A) 0.1%
- (in symbol RN_10K_VISHAY_AORN1002A, part B) 0.1%
- (in symbol RN_10K_VISHAY_AORN1002A, part C) 0.1%
- (in symbol RN_10K_VISHAY_AORN1002A, part D) 0.1%

### Library data of the parts
C1 = CC0603_100PF_50V_1%_NP0: Non-polarised capacitor; Part Description: SMD Multilayer Chip Ceramic Capacitor; Manufacturer: GENERIC; Manufacturer1 Part Number: 06035A101FAT2A; Voltage: 50V; TC: C0G/NP0; Tolerance: ±1%; Part Number: CC0603_100PF_50V_1%_NP0; Component Kind: Standard; Component Type: Standard; Pin Count: 2; Value: 100pF; Status: None; Manufacturer Part Number: CC0603_100PF_50V_1%_NP0; Case: 0603; Mounted: Yes; Socket: No; SMD: Yes; Sense: No; Manufacturer1 Example: AVX; Manufacturer1 ComponentHeight: 0.9mm; HelpURL: \\cern.ch\dfs\Applications\Altium\Datasheets\CC0603_C0G_AVX.pdf; Author: CERN DEM JLC; CreateDate: 15.06.2017; LatestRevisionDate: 15.06.2017
C2 = CC0402_10PF_50V_5%_C0G: Non-polarised capacitor; Part Description: SMD Multilayer Chip Ceramic Capacitor; Manufacturer: GENERIC; Manufacturer1 Part Number: C0402C100J5GACTU; Voltage: 50V; TC: C0G/NP0; Tolerance: ±5%; Part Number: CC0402_10PF_50V_5%_C0G; Component Kind: Standard; Component Type: Standard; Pin Count: 2; Value: 10pF; Status: Preferred; Manufacturer Part Number: CC0402_10PF_50V_5%_C0G; Case: 0402; Mounted: Yes; Socket: No; SMD: Yes; Sense: No; Manufacturer1 Example: KEMET; Manufacturer1 ComponentHeight: 0.55mm; HelpURL: \\cern.ch\dfs\Applications\Altium\Datasheets\CC0805_C0G_KEMET_(Commercial Grade).pdf; Author: CERN DEM JLC; CreateDate: 03.12.2007; LatestRevisionDate: 22.04.2015
C3 C106 = CC0402_47PF_50V_1%_C0G_MURATA_GJM1555C1H470FB01D: Non-polarised capacitor; Part Description: High-Q SMD Chip Monolithic Ceramic Capacitor; Manufacturer: MURATA; Voltage: 50V; TC: C0G/NP0; Tolerance: ±1%; Part Number: CC0402_47PF_50V_1%_C0G_MURATA_GJM1555C1H470FB01D; Component Kind: Standard; Component Type: Standard; Pin Count: 2; Status: None; Case: 0402; Mounted: Yes; Socket: No; SMD: Yes; Sense: No; ComponentHeight: 0.55mm; HelpURL: \\cern.ch\dfs\Applications\Altium\Datasheets\CC0402_MURATA_GJM1555C1H470FB01D.pdf; Author: CERN DEM BC; CreateDate: 20.11.2017; LatestRevisionDate: 20.11.2017
  C3: Value: 47pF; Manufacturer Part Number: GJM1555C1H470FB01D
  C106: Manufacturer Part Number: GJM1555C1H470FB01
C12 C97-C99 C138 = CTE3216-18_10UF_16V_20%_AVX_TCJ: Polarised capacitor; Part Description: ESR 0R200 Tantalum Solid Electrolytic Chip Capacitor with Conductive Polymer Electrode; Manufacturer: AVX; Manufacturer Part Number: TCJA106M016R0200 or  or TR3A106K016C1700; Voltage: 16V; Tolerance: ±20%; Part Number: CTE3216-18_10UF_16V_20%_AVX_TCJ; Component Kind: Standard; Component Type: Standard; Pin Count: 2; Value: 10uF; Status: Preferred; Case: A; Mounted: Yes; Socket: No; SMD: Yes; Sense: No; ComponentHeight: 1.8mm; HelpURL: \\cern.ch\dfs\Applications\Altium\Datasheets\CTE_AVX_TCJ.pdf; Author: CERN DEM JLC; CreateDate: 29.03.2012; LatestRevisionDate: 29.03.2012
C35 C66 C68 C89 = CC0603_15PF_50V_5%_NP0: Non-polarised capacitor; Part Description: SMD Multilayer Chip Ceramic Capacitor; Manufacturer: GENERIC; Manufacturer1 Part Number: 223886715159; Voltage: 50V; TC: C0G/NP0; Tolerance: ±5%; Part Number: CC0603_15PF_50V_5%_NP0; Component Kind: Standard; Component Type: Standard; Pin Count: 2; Value: 15pF; Status: Preferred; Manufacturer Part Number: CC0603_15PF_50V_5%_NP0; Case: 0603; Mounted: Yes; Socket: No; SMD: Yes; Sense: No; Manufacturer1 Example: PHYCOMP; Manufacturer1 ComponentHeight: 0.87mm; HelpURL: \\cern.ch\dfs\Applications\Altium\Datasheets\CC0603_NP0_PHYCOMP.pdf; Author: CERN DEM JLC; CreateDate: 03/12/2007; LatestRevisionDate: 03/12/2007
C92 C101 C142 C143 C154 = CC0402_100NF_16V_10%_X7R: Non-polarised capacitor; Part Description: SMD Multilayer Chip Ceramic Capacitor; Manufacturer: GENERIC; Manufacturer1 Part Number: GRM155R71C104KA88D; Voltage: 16V; TC: X7R; Tolerance: ±10%; Part Number: CC0402_100NF_16V_10%_X7R; Component Kind: Standard; Component Type: Standard; Pin Count: 2; Value: 100nF; Status: Not Recommended; Manufacturer Part Number: CC0402_100NF_16V_10%_X7R; Case: 0402; Mounted: Yes; Socket: No; SMD: Yes; Sense: No; Manufacturer1 Example: MURATA; Manufacturer1 ComponentHeight: 0.55mm; HelpURL: \\cern.ch\dfs\Applications\Altium\Datasheets\CC0402_X7R_MURATA_GRM.pdf; Author: CERN DEM JLC; CreateDate: 2013-12-05; LatestRevisionDate: 2007-12-03
D21 = BAV199: Serial Diode; Part Description: Low-Leakage Double Diode; Manufacturer: NXP SEMICONDUCTORS; Voltage: 75V; Power: 250mW; PressFit: No; Bonding: No; Part Number: BAV199; Component Kind: Standard; Component Type: Standard; Device: BAV199; PackageDescription: SOT23 3-Leads, Pitch 0.95mm - Body 1.4x3mm, IPC Medium Density; Manufacturer Part Number: BAV199; Pin Count: 3; Case: SOT23-3; Mounted: Yes; Socket: No; SMD: Yes; Sense: No; ComponentHeight: 1.1mm; HelpURL: \\cern.ch\dfs\Applications\Altium\Datasheets\BAV199.pdf; Author: CERN DEM JMW; CreateDate: 2008-11-21; LatestRevisionDate: 2008-11-21
IC5 = OA_OPA2197IDGKR: 36-V, Precision, Rail-to-Rail Input Output, Low Offset Voltage Op Amp 8-VSSOP; Part Description: High-Precision, Low-Noise, Rail-to-Rail Output,10-MHz Op Amp; Manufacturer: TEXAS INSTRUMENTS; PressFit: No; Bonding: No; Part Number: OPA2197IDGKR; Component Kind: Standard; Component Type: Standard; Device: OPA2197IDGKR; PackageDescription: SOP, 0.65mm pitch; 8 pin, 3.00mm W X 3.00mm L X 1.10mm H body, IPC Medium Density; Manufacturer Part Number: OPA2197IDGKR; Pin Count: 8; Case: MSOP8; Mounted: Yes; Socket: No; SMD: Yes; Sense: No; ComponentHeight: 1.1mm; Author: GK; HelpURL: \\cern.ch\dfs\Applications\Altium\Datasheets\OPA2140AIDGK.pdf; CreateDate: 20.04.2017; LatestRevisionDate: 20.04.2017
IC37 = AD5542ABCPZ-REEL7: 2.7V to 5.5V, Serial-Input, Voltage-Output, 16-Bit DAC; Manufacturer: ANALOG DEVICES; PressFit: No; Bonding: No; Part Number: AD5542ABCPZ-REEL7; Component Kind: Standard; Component Type: Standard; Device: AD5542ABCPZ-REEL7; PackageDescription: QFN, 0.50mm Pitch, Square; 16 Pin, 3.00mm L X 3.00mm W X 0.80mm H Body (w/Thermal Tab 1.75 X 1.75mm),  IPC Medium Density; Part Description: 2.7V to 5.5V, Serial-Input, Voltage-Output, 16-Bit DAC; Manufacturer Part Number: AD5542ABCPZ-REEL7; Pin Count: 17; Case: QFN16; Mounted: Yes; Socket: No; SMD: Yes; Sense: No; ComponentHeight: 0.8mm; Author: CERN DEM JLC; HelpURL: \\cern.ch\dfs\Applications\Altium\Datasheets\AD5542ABCPZ-REEL7.pdf; CreateDate: 29.11.2018; LatestRevisionDate: 29.11.2018
L2 L16 L18 = IND0402_MURATA_BLM15HD601SN1: Inductor; Part Description: SMD EMIFIL Suppression Chip Ferrite Bead; Manufacturer: MURATA; Manufacturer Part Number: BLM15HD601SN1D; Power: 300mA; Resistance: 0.85R; Tolerance: ±25%; Part Number: IND0402_MURATA_BLM15HD601SN1; Component Kind: Standard; Component Type: Standard; Pin Count: 2; Value: 600R@100MHz; Status: None; Case: 0402; Mounted: Yes; Socket: No; SMD: Yes; Sense: No; ComponentHeight: 0.55mm; HelpURL: \\cern.ch\dfs\Applications\Altium\Datasheets\IND0402_MURATA_BLM15H.pdf; Author: CERN DEM JLC; CreateDate: 28/02/2012; LatestRevisionDate: 28/02/2012
R2 = R0603_30R_1%_0.1W_100PPM: Resistor - 1%; Part Description: General Purpose Thick Film Chip Resistor; Manufacturer: GENERIC; Manufacturer1 Part Number: NRC06F30R0TRF; Power: 0.1W; TC: ±100ppm/°C; PressFit: No; Part Number: R0603_30R_1%_0.1W_100PPM; Component Kind: Standard; Component Type: Standard; Pin Count: 2; Value: 30; Status: Preferred; Tolerance: ±1%; Manufacturer Part Number: R0603_30R_1%_0.1W_100PPM; Case: 0603; Mounted: Yes; Sense: No; Socket: No; SMD: Yes; Manufacturer1 Example: NIC COMPONENT; Manufacturer1 ComponentHeight: 0.55mm; HelpURL: \\cern.ch\dfs\Applications\Altium\Datasheets\R0603_NIC_NRC.pdf; Author: CERN DEM JLC; CreateDate: 03/12/2007; LatestRevisionDate: 13/03/2008
R9 = R0603_1K47_0.1%_0.063W_10PPM: Resistor - 0.1%; Part Description: Thin Film Chip Resistor; Manufacturer: GENERIC; Manufacturer1 Part Number: RN73C1J1K47BTDF; Power: 0.063W; TC: ±10ppm; PressFit: No; Part Number: R0603_1K47_0.1%_0.063W_10PPM; Component Kind: Standard; Component Type: Standard; Pin Count: 2; Value: 1k47; Status: Not Recommended; Tolerance: ±0.1%; Manufacturer Part Number: R0603_1K47_0.1%_0.063W_10PPM; Case: 0603; Mounted: Yes; Sense: No; Socket: No; SMD: Yes; Manufacturer1 Example: TYCO HOLSWORTHY; Manufacturer1 ComponentHeight: 0.5mm; HelpURL: \\cern.ch\dfs\Applications\Altium\Datasheets\R0603_Tyco_RN73.pdf; Author: CERN DEM JLC; CreateDate: 03.12.2007; LatestRevisionDate: 13.03.2008
R11 = R0603_1K69_0.1%_0.063W_10PPM: Resistor - 0.1%; Part Description: Thin Film Chip Resistor; Manufacturer: GENERIC; Manufacturer1 Part Number: RN73C1J1K69BTDF; Power: 0.063W; TC: ±10ppm; PressFit: No; Part Number: R0603_1K69_0.1%_0.063W_10PPM; Component Kind: Standard; Component Type: Standard; Pin Count: 2; Value: 1k69; Status: Not Recommended; Tolerance: ±0.1%; Manufacturer Part Number: R0603_1K69_0.1%_0.063W_10PPM; Case: 0603; Mounted: Yes; Sense: No; Socket: No; SMD: Yes; Manufacturer1 Example: TYCO HOLSWORTHY; Manufacturer1 ComponentHeight: 0.5mm; HelpURL: \\cern.ch\dfs\Applications\Altium\Datasheets\R0603_Tyco_RN73.pdf; Author: CERN DEM JLC; CreateDate: 03.12.2007; LatestRevisionDate: 13.03.2008
R67 = R0603_0R_JUMPER: as R17 on sheet Fastino; Part Number: R0603_0R_JUMPER; Component Kind: Standard; Component Type: Standard; Pin Count: 2; Value: 0; Status: Preferred; Manufacturer Part Number: R0603_0R_JUMPER; Case: 0603; Mounted: Yes; Sense: No; Socket: No; SMD: Yes; Manufacturer1 Example: NIC COMPONENT; Manufacturer1 ComponentHeight: 0.55mm; HelpURL: \\cern.ch\dfs\Applications\Altium\Datasheets\R0603_NIC_NRC.pdf; Author: CERN DEM JLC; CreateDate: 03.12.2007; LatestRevisionDate: 13.03.2008
R153 = R0402_0R_JUMPER: Resistor; Part Description: 1A (0.05R Max DC Resistance) Zero Ohm Jumper; Manufacturer: GENERIC; Manufacturer1 Part Number: 232270591001L; PressFit: No; Part Number: R0402_0R_JUMPER; Component Kind: Standard; Component Type: Standard; Pin Count: 2; Value: 0; Status: Not Recommended; Manufacturer Part Number: R0402_0R_JUMPER; Case: 0402; Mounted: Yes; Sense: No; Socket: No; SMD: Yes; Manufacturer1 Example: YAGEO PHYCOMP; Manufacturer1 ComponentHeight: 0.4mm; HelpURL: \\cern.ch\dfs\Applications\Altium\Datasheets\R0402_Phycomp_RC0402.pdf; Author: CERN DEM JLC; CreateDate: 03.12.2007; LatestRevisionDate: 17.10.2012
R164 = R0402_10R_1%_0.0625W_200PPM: Resistor - 1%; Part Description: General Purpose Thick Film Chip Resistor; Manufacturer: GENERIC; Manufacturer1 Part Number: 232270671009L; TC: ±200ppm/°C; PressFit: No; Part Number: R0402_10R_1%_0.0625W_200PPM; Component Kind: Standard; Component Type: Standard; Pin Count: 2; Value: 10; Status: Not Recommended; Power: 0.0625W; Tolerance: ±1%; Manufacturer Part Number: R0402_10R_1%_0.0625W_200PPM; Case: 0402; Mounted: Yes; Sense: No; Socket: No; SMD: Yes; Manufacturer1 Example: YAGEO PHYCOMP; Manufacturer1 ComponentHeight: 0.4mm; HelpURL: \\cern.ch\dfs\Applications\Altium\Datasheets\R0402_Phycomp_RC0402.pdf; Author: CERN DEM JLC; CreateDate: 24.06.2009; LatestRevisionDate: 17.10.2012
R297 = R0201_0R_JUMPER: Resistor; Part Description: 1A (0.05R Max DC Resistance) Zero Ohm Jumper; Manufacturer: GENERIC; Manufacturer1 Part Number: CRCW02010000Z0ED; PressFit: No; Part Number: R0201_0R_JUMPER; Component Kind: Standard; Component Type: Standard; Pin Count: 2; Value: 0; Status: Not Recommended; Manufacturer Part Number: R0201_0R_JUMPER; Case: 0201; Mounted: Yes; Sense: No; Socket: No; SMD: Yes; Manufacturer1 Example: VISHAY; Manufacturer1 ComponentHeight: 0.27mm; HelpURL: \\cern.ch\dfs\Applications\Altium\Datasheets\R0201_VISHAY_CRCW e3.pdf; Author: CERN DEM JLC; CreateDate: 19.11.2014; LatestRevisionDate: 08.01.2015
RN1 = RES_RN_100R_YAGEO_TC124-JR-07100RL: DIL8 Resistor Network 4 Isolated Resistor 5%; Part Description: Chip Resistor Array , 4 Isolated Resistors (Side Concave Terminal), TC124 Series; Manufacturer: YAGEO; Power: 0.062W; TC: ±200ppm/°C; PressFit: No; Part Number: RN_100R_YAGEO_TC124-JR-07100RL; Component Kind: Standard; Component Type: Standard; Pin Count: 8; Value: 100; Sense: No; Status: Not recommended; Tolerance: ±5%; Manufacturer Part Number: TC124-JR-07100RL; Case: 0408; Mounted: Yes; Socket: No; SMD: Yes; ComponentHeight: 0.5mm; HelpURL: \\cern.ch\dfs\Applications\Altium\Datasheets\RN_YAGEO_TC124.pdf; Author: CERN DEM BC; CreateDate: 06.05.2019; LatestRevisionDate: 06.05.2019
RN5 = RN_10K_VISHAY_AORN1002A: DIL8 Resistor Network 4 Isolated Resistor 0.1%; Part Description: Dual-In-Line Thin Film Precision Automotive Resistors Network, (4 Isolated) - AORN Series; Manufacturer: VISHAY DALE; Power: 4x0.1W; TC: ±25ppm/°C; PressFit: No; Part Number: RN_10K_VISHAY_AORN1002A; Component Kind: Standard; Component Type: Standard; Pin Count: 8; Value: 10k; Sense: No; Tolerance: ±0.1%; Case: SOIC8; Mounted: Yes; Socket: No; SMD: Yes; ComponentHeight: 1.73mm; HelpURL: \\cern.ch\dfs\Applications\Altium\Datasheets\RN_VISHAY_AORN.pdf; Author: CERN DEM JLC; CreateDate: 20.02.2017; LatestRevisionDate: 03.05.2017